# Altium schematic sheet MCU.SchDoc (part 3 of 3)
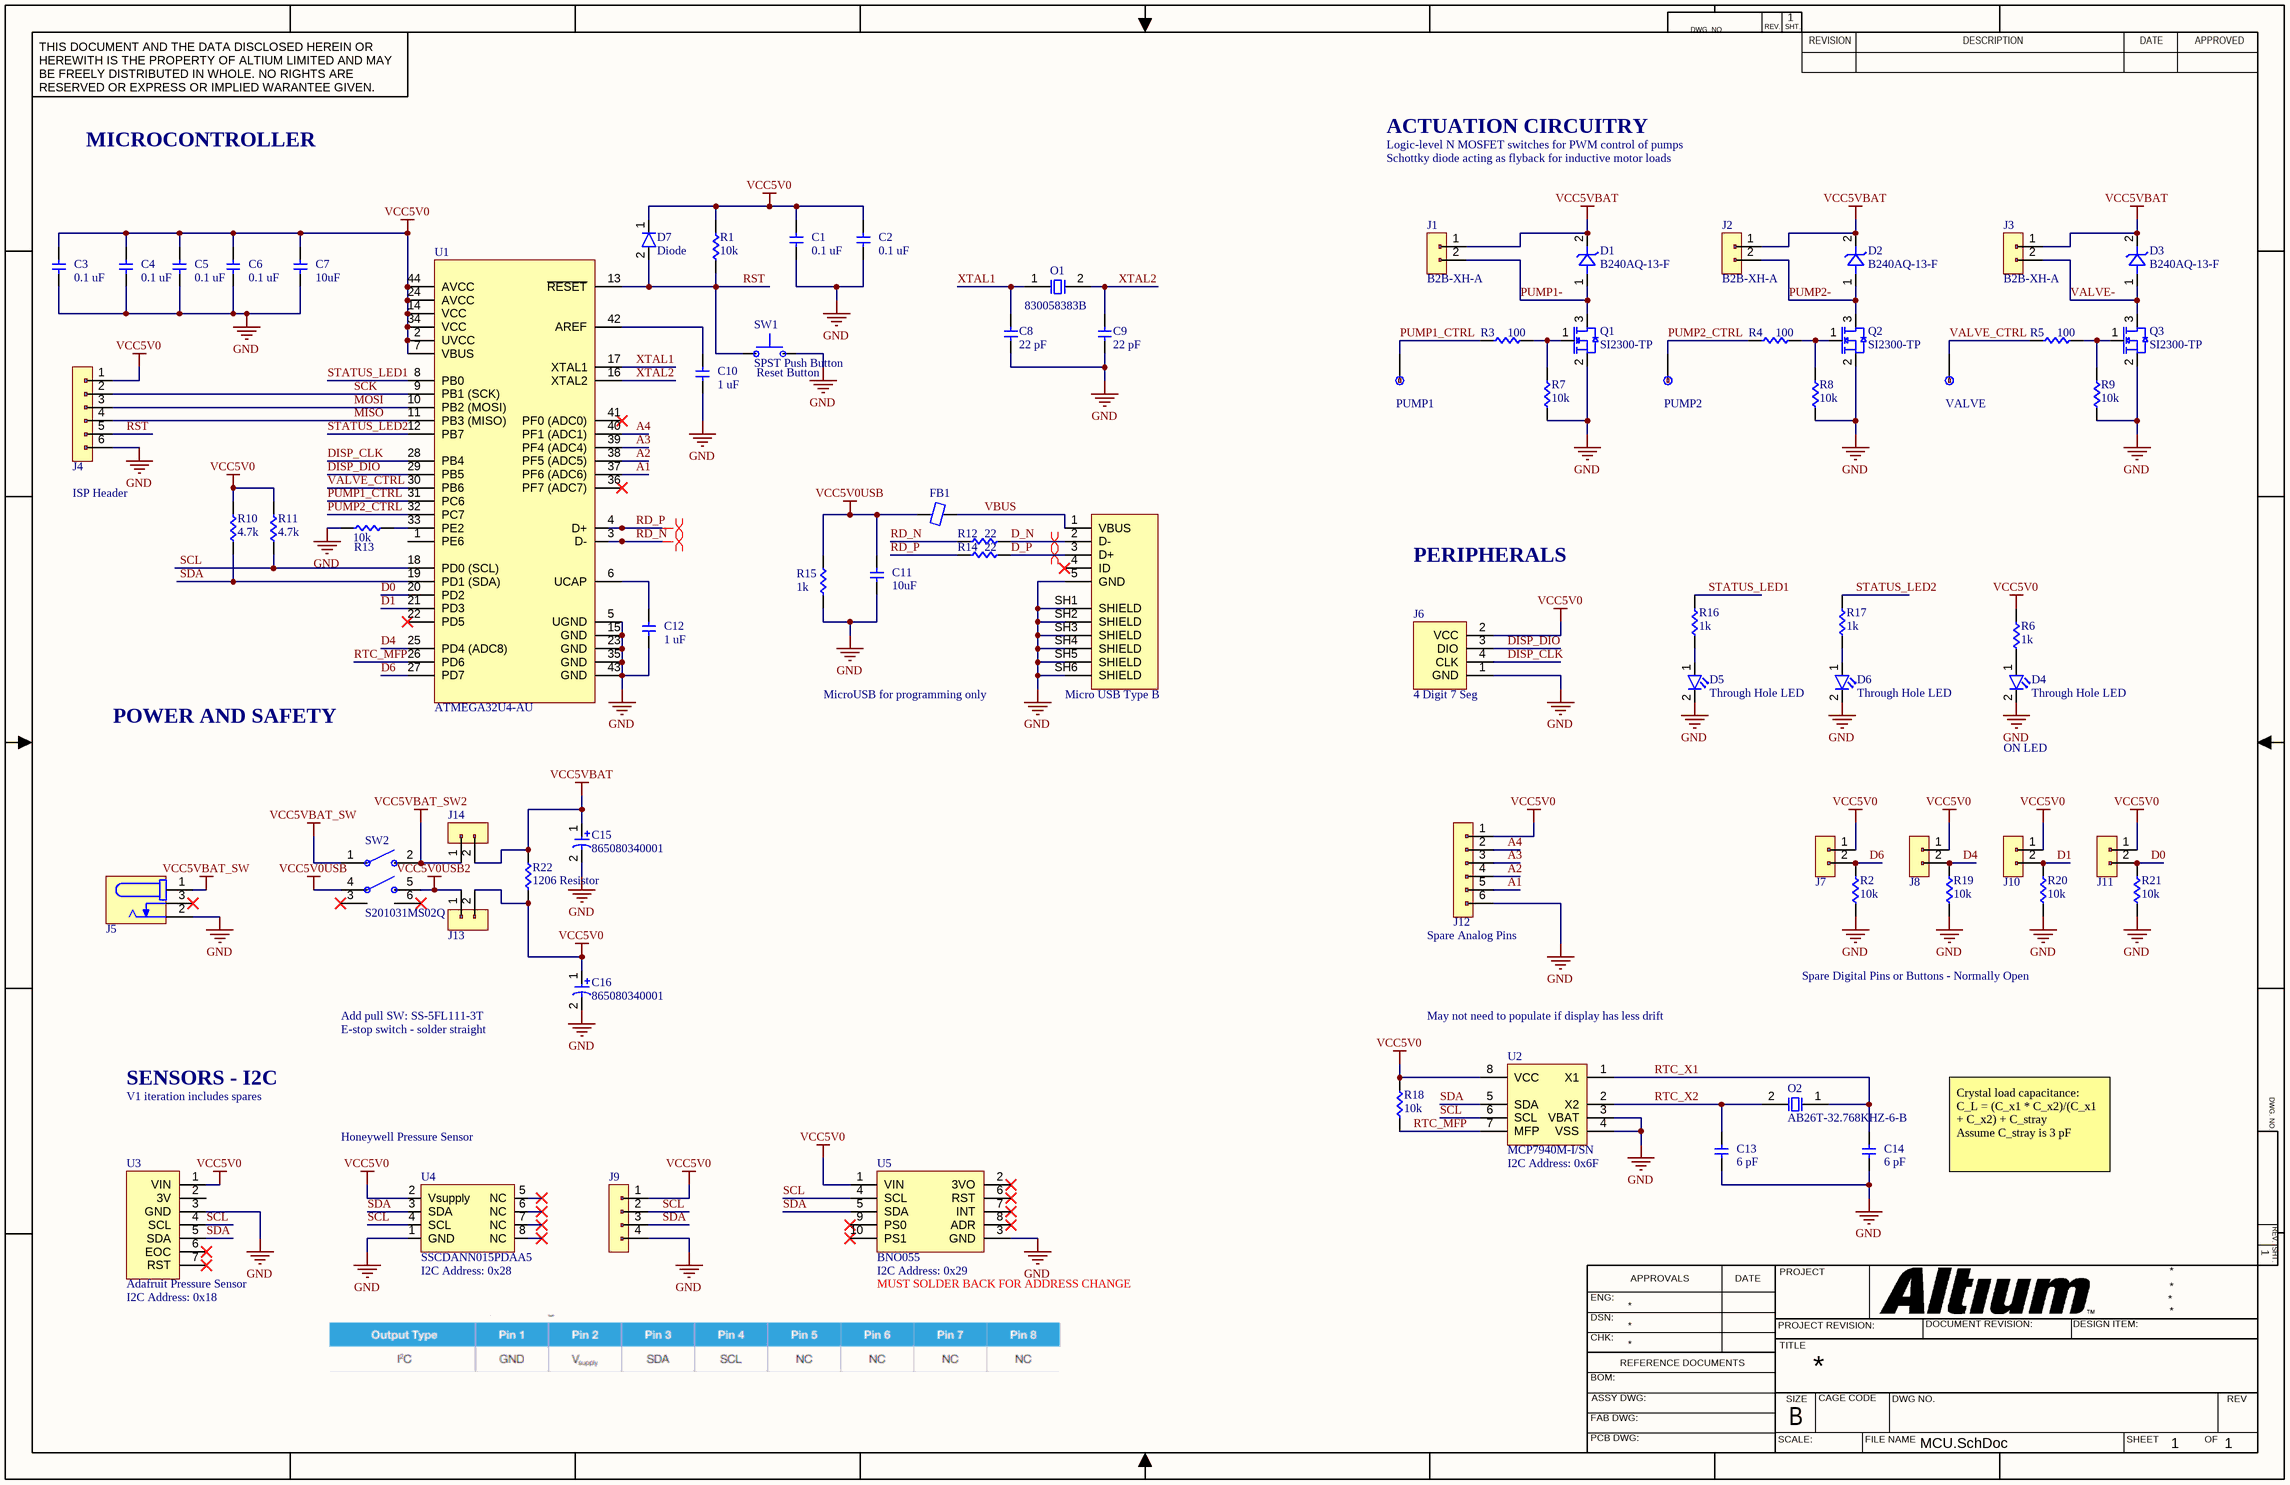
[diagram p2: MCU.SchDoc]

## Library data of the parts (continued)
U1 = ATMEGA32U4-AU: Microcontroller, Usb Controller 16/32K Of Isp Flash, TQFP44 Industrial, 8-BIT; Manufacturer: Microchip; Core Architecture: AVR; Data Bus Width: 8b; Frequency: 16MHz; Interface: I2C, I2S, SPI, UART, USART, USB; Max Supply Voltage: 5.5V; Memory Size: 32kB; Min Supply Voltage: 2.7V; Number of ADC Channels: 12; Number of I2C Channels: 1; Number of I/Os: 26; Number of PWM Channels: 8; Number of Timers/Counters: 5; Oscillator Type: External; Peripherals: Brown-out Detect/Reset, POR, PWM, WDT; RAM Size: 2.5kB; Watchdog Timer: Yes; Supplier: DigiKey; Supplier Part Number: ATMEGA32U4-AU-ND; Manufacturer Part Number: ATMEGA32U4-AU; RoHS: Compliant; Category: Microcontrollers; Stock: 7673; Pricing: 1=5.29, 25=4.84, 100=4.39 (USD); Projected EOL Date: 2039-11-04; Case/Package: TQFP; Country of Assembly: Philippines, Thailand; Country of Fabrication: United States of America; Country of Origin: Philippines, Thailand; Export Control Classification Number (ECCN) Code: EAR99; Height: 1.05mm; Harmonized Tariff Schedule (HTS) Code: 8542.31.0015; Lead Free: Lead Free; Length: 10mm; Lifecycle Status: Production; Clock Frequency: 16MHz; Max Operating Temperature: 85°C; Memory Format: FLASH; Manufacturer Package Identifier: ATMEGA32U4-AU; Min Operating Temperature: -40°C; Mounting Technology: Surface Mount; Pins: 44; Number of Programmable I/O: 26; Number of SPI Channels: 1; Radiation Hardening: No; REACH SVHC: No; Schedule B: 8542310000, 8542310000|8542310000|8542310000|8542310000|8542310000; Width: 10mm; ComponentLink1URL: https://datasheet.octopart.com:443/ATMEGA32U4-AU-Microchip-datasheet-101746192.pdf?src-supplier=Upverter; ComponentLink1Description: https://datasheet.octopart.com:443/ATMEGA32U4-AU-Microchip-datasheet-101746192.pdf?src-supplier=Upverter; ComponentLink2URL: https://datasheet.octopart.com:443/ATMEGA32U4-AU-Microchip-datasheet-24967522.pdf?src-supplier=Upverter; ComponentLink2Description: https://datasheet.octopart.com:443/ATMEGA32U4-AU-Microchip-datasheet-24967522.pdf?src-supplier=Upverter; ComponentLink3URL: https://datasheet.octopart.com:443/ATMEGA32U4-AU-Microchip-datasheet-65729178.pdf?src-supplier=TME; ComponentLink3Description: https://datasheet.octopart.com:443/ATMEGA32U4-AU-Microchip-datasheet-65729178.pdf?src-supplier=TME; ComponentLink4URL: https://datasheet.octopart.com:443/ATMEGA32U4-AU-Atmel-datasheet-10917087.pdf?src-supplier=TME; ComponentLink4Description: https://datasheet.octopart.com:443/ATMEGA32U4-AU-Atmel-datasheet-10917087.pdf?src-supplier=TME; ComponentLink5URL: https://datasheet.octopart.com:443/ATMEGA32U4-AU-Microchip-datasheet-13542643.pdf?src-supplier=element14+APAC; ComponentLink5Description: https://datasheet.octopart.com:443/ATMEGA32U4-AU-Microchip-datasheet-13542643.pdf?src-supplier=element14+APAC; ComponentLink6URL: https://datasheet.octopart.com:443/ATMEGA32U4-AU-Microchip-datasheet-62316224.pdf?src-supplier=element14+APAC; ComponentLink6Description: https://datasheet.octopart.com:443/ATMEGA32U4-AU-Microchip-datasheet-62316224.pdf?src-supplier=element14+APAC; ComponentLink7URL: https://datasheet.octopart.com:443/ATMEGA32U4-AU-Atmel-datasheet-13432554.pdf?src-supplier=Newark; ComponentLink7Description: https://datasheet.octopart.com:443/ATMEGA32U4-AU-Atmel-datasheet-13432554.pdf?src-supplier=Newark; ComponentLink8URL: https://datasheet.octopart.com:443/ATMEGA32U4-AU-Atmel-datasheet-8370675.pdf?src-supplier=Newark; ComponentLink8Description: https://datasheet.octopart.com:443/ATMEGA32U4-AU-Atmel-datasheet-8370675.pdf?src-supplier=Newark; ComponentLink9URL: https://datasheet.octopart.com:443/ATMEGA32U4-AU-Atmel-datasheet-8828238.pdf?src-supplier=element14; ComponentLink9Description: https://datasheet.octopart.com:443/ATMEGA32U4-AU-Atmel-datasheet-8828238.pdf?src-supplier=element14; ComponentLink10URL: https://datasheet.octopart.com:443/ATMEGA32U4-AU-Atmel-datasheet-8383889.pdf?src-supplier=element14; ComponentLink10Description: https://datasheet.octopart.com:443/ATMEGA32U4-AU-Atmel-datasheet-8383889.pdf?src-supplier=element14; ComponentLink11URL: https://datasheet.octopart.com:443/ATMEGA32U4-AU-Atmel-datasheet-14106918.pdf?src-supplier=iiiC; ComponentLink11Description: https://datasheet.octopart.com:443/ATMEGA32U4-AU-Atmel-datasheet-14106918.pdf?src-supplier=iiiC; ComponentLink12URL: http://sigma.octopart.com:80/188450203/materials_sheet/Microchip-ATMEGA32U4-AU.pdf?src-supplier=Compliance+Statements; ComponentLink12Description: http://sigma.octopart.com:80/188450203/materials_sheet/Microchip-ATMEGA32U4-AU.pdf?src-supplier=Compliance+Statements; ComponentLink13URL: http://sigma.octopart.com:80/rohs_statement/Microchip-company-71.pdf?src-supplier=Compliance+Statements; ComponentLink13Description: http://sigma.octopart.com:80/rohs_statement/Microchip-company-71.pdf?src-supplier=Compliance+Statements; ComponentLink14URL: http://sigma.octopart.com:80/reach_statement/Microchip-company-70.pdf?src-supplier=Compliance+Statements; ComponentLink14Description: http://sigma.octopart.com:80/reach_statement/Microchip-company-70.pdf?src-supplier=Compliance+Statements; ComponentLink15URL: http://sigma.octopart.com:80/conflict_mineral_statement/Microchip-company-69.pdf?src-supplier=Compliance+Statements; ComponentLink15Description: http://sigma.octopart.com:80/conflict_mineral_statement/Microchip-company-69.pdf?src-supplier=Compliance+Statements; ComponentLink16URL: http://sigma.octopart.com:80/conflict_mineral_statement/Microchip-company-68.pdf?src-supplier=Compliance+Statements; ComponentLink16Description: http://sigma.octopart.com:80/conflict_mineral_statement/Microchip-company-68.pdf?src-supplier=Compliance+Statements; ComponentLink17URL: http://sigma.octopart.com:80/reach_statement/Atmel-company-6.pdf?src-supplier=Compliance+Statements; ComponentLink17Description: http://sigma.octopart.com:80/reach_statement/Atmel-company-6.pdf?src-supplier=Compliance+Statements; ComponentLink18URL: http://sigma.octopart.com:80/rohs_statement/Atmel-company-5.pdf?src-supplier=Compliance+Statements; ComponentLink18Description: http://sigma.octopart.com:80/rohs_statement/Atmel-company-5.pdf?src-supplier=Compliance+Statements; ComponentLink19URL: http://sigma.octopart.com:80/rohs_statement/Atmel-company-4.pdf?src-supplier=Compliance+Statements; ComponentLink19Description: http://sigma.octopart.com:80/rohs_statement/Atmel-company-4.pdf?src-supplier=Compliance+Statements
U2 = MCP7940M: RTC Clock; Part Number: 0878310641; Manufacturer: Molex; Number of Positions: 6; Current Rating: 2A; Voltage Rating: 125V; Gender: Male; Reviewed: No; Manufacturer Part Number: 0878310641; Series: Milli-Grid 87831; Mount: Through Hole; Number of Rows: 2; Fastening Type: Latch Holder; Orientation: Vertical; Min Operating Temperature: -55°C; Max Operating Temperature: 105°C; Supplier 1: Digi-Key; Supplier Part Number 1: WM3590-ND; ComponentLink1URL: https://tools.molex.com/pdm_docs/ps/PS-87831-027.pdf; ComponentLink1Description: Datasheet
U3 = Adafruit MPRLS Ported Pressure Sensor: Manufacturer: Wurth Elektronik; Manufacturer Part Number: 61300711121; Connector Type: Male Pin; Contact Resistance: 20mΩ; Current Rating: 3A; Gender: Male; Insulation Resistance: 1GΩ; Number of Contacts: 7; Operating Supply Voltage: 250V; Pitch: 2.54mm; Supplier: DigiKey; Supplier Part Number: 732-5320-ND; RoHS: Compliant; Category: Headers and Wire Housings; Stock: 8639; Pricing: 1=0.36, 10=0.302, 25=0.252, 50=0.2106, 100=0.1908, 1000=0.17375 (USD); Color: Black; Contact Material: Copper; Contact Mating Length: 5.9944mm; Contact Plating: Gold; Lead Pitch: 2.54mm; Length: 17.78mm; Max Operating Temperature: 105°C; Min Operating Temperature: -40°C; Mounting Technology: Through Hole; Pins: 7; Number of Positions: 7; Number of Rows: 1; Orientation: Vertical; Packaging: Bulk; Termination: Solder; ComponentLink1URL: https://datasheet.octopart.com:443/61300711121-Wurth-Elektronik-datasheet-169474601.pdf?src-supplier=Wurth+Elektronik; ComponentLink1Description: https://datasheet.octopart.com:443/61300711121-Wurth-Elektronik-datasheet-169474601.pdf?src-supplier=Wurth+Elektronik; ComponentLink2URL: https://datasheet.octopart.com:443/61300711121-W%C3%BCrth-Elektronik-datasheet-44382959.pdf?src-supplier=Wurth+Elektronik; ComponentLink2Description: https://datasheet.octopart.com:443/61300711121-W%C3%BCrth-Elektronik-datasheet-44382959.pdf?src-supplier=Wurth+Elektronik; ComponentLink3URL: https://datasheet.octopart.com:443/61300711121-W%C3%BCrth-Elektronik-datasheet-149524083.pdf?src-supplier=Farnell; ComponentLink3Description: https://datasheet.octopart.com:443/61300711121-W%C3%BCrth-Elektronik-datasheet-149524083.pdf?src-supplier=Farnell; ComponentLink4URL: https://datasheet.octopart.com:443/61300711121-W%C3%BCrth-Elektronik-datasheet-21154836.pdf?src-supplier=element14+APAC; ComponentLink4Description: https://datasheet.octopart.com:443/61300711121-W%C3%BCrth-Elektronik-datasheet-21154836.pdf?src-supplier=element14+APAC
U4 = SSCDANN015PDAA5: Pressure Sensor ±15PSI (±103.42kPa) Differential Male - 0.19" (4.93mm) Tube 0.5 V ~ 4.5 V 8-DIP (0.524", 13.30mm), Top Port; Manufacturer: Sullins; Manufacturer Part Number: NPTC041KFXC-RC; Connector Type: Header, Socket; Current Rating: 3A; Dielectric Material: Polyamide; Number of Positions: 4; Pitch: 2.54mm; Supplier: DigiKey; Supplier Part Number: S5596-ND; RoHS: Compliant; Category: Card Edge Connectors; Stock: 44539; Pricing: 1=0.57, 58=0.43086, 116=0.41026, 522=0.36887, 1044=0.35125, 5046=0.31428, 10034=0.30044 (USD); Color: Black; Contact Gender: Female; Contact Material: Bronze; Contact Plating: Tin; Height: 7.1mm; Housing Color: Black; Housing Material: Nylon; Lead Free: Lead Free; Length: 10.2mm; Lifecycle Status: Production; Mounting Technology: Surface Mount; Pins: 4; Number of Rows: 2; Packaging: Bulk; REACH SVHC: Yes; Terminal Pitch: 5.08mm; Termination: Solder; Width: 2.5mm; ComponentLink1URL: https://datasheet.octopart.com:443/NPTC041KFXC-RC-Sullins-datasheet-138810743.pdf?src-supplier=IHS; ComponentLink1Description: https://datasheet.octopart.com:443/NPTC041KFXC-RC-Sullins-datasheet-138810743.pdf?src-supplier=IHS; ComponentLink2URL: https://datasheet.octopart.com:443/NPTC041KFXC-RC-Sullins-datasheet-41308905.pdf?src-supplier=Future+Electronics; ComponentLink2Description: https://datasheet.octopart.com:443/NPTC041KFXC-RC-Sullins-datasheet-41308905.pdf?src-supplier=Future+Electronics; ComponentLink3URL: https://datasheet.octopart.com:443/NPTC041KFXC-RC-Sullins-datasheet-120059.pdf?src-supplier=DigiKey; ComponentLink3Description: https://datasheet.octopart.com:443/NPTC041KFXC-RC-Sullins-datasheet-120059.pdf?src-supplier=DigiKey
U5 = BNO055: IMU; Manufacturer: Adafruit; Manufacturer Part Number: 0878310641; Number of Positions: 6; Current Rating: 2A; Voltage Rating: 125V; Gender: Male; Reviewed: No; Part Number: BNO055; Series: Milli-Grid 87831; Mount: Through Hole; Number of Rows: 2; Fastening Type: Latch Holder; Orientation: Vertical; Min Operating Temperature: -55°C; Max Operating Temperature: 105°C; Supplier 1: Digi-Key; Supplier Part Number 1: WM3590-ND; ComponentLink1URL: https://tools.molex.com/pdm_docs/ps/PS-87831-027.pdf; ComponentLink1Description: Datasheet